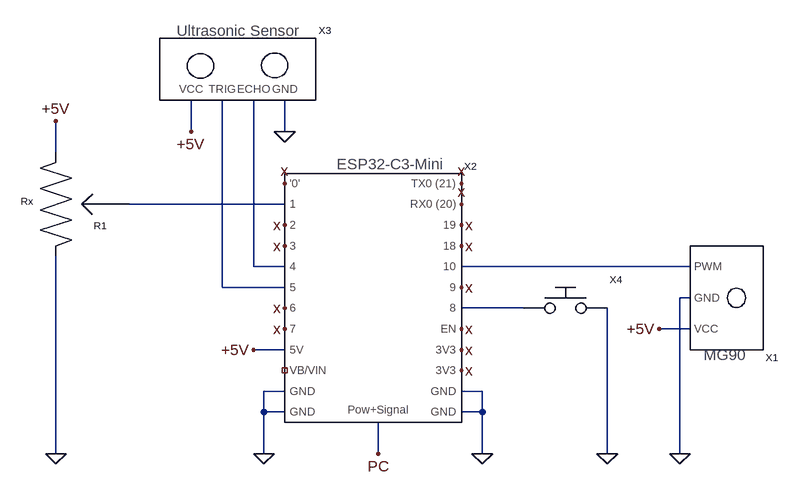
[diagram p0: schematic radar_schematic.asc]
radar_schematic.asc, the LTspice schematic file:
Version 4.1
SHEET 1 1668 1076
WIRE 640 128 640 80
WIRE 784 128 784 80
WIRE 432 160 432 112
WIRE 784 240 544 240
WIRE 736 336 736 80
WIRE 784 336 736 336
WIRE 1408 336 1056 336
WIRE 688 368 688 80
WIRE 784 368 688 368
WIRE 1408 384 1392 384
WIRE 1152 400 1056 400
WIRE 1408 432 1360 432
WIRE 784 464 736 464
WIRE 784 528 752 528
WIRE 1088 528 1056 528
WIRE 752 560 752 528
WIRE 784 560 752 560
WIRE 1088 560 1088 528
WIRE 1088 560 1056 560
WIRE 432 624 432 320
WIRE 752 624 752 560
WIRE 928 624 928 576
WIRE 1088 624 1088 560
WIRE 1280 624 1280 400
WIRE 1392 624 1392 384
FLAG 1088 624 0
FLAG 752 624 0
FLAG 640 128 +5V
FLAG 1360 432 +5V
FLAG 784 128 0
FLAG 784 208 x
FLAG 784 272 x
FLAG 784 400 x
FLAG 784 432 x
FLAG 1056 464 x
FLAG 1056 496 x
FLAG 1056 432 x
FLAG 1056 368 x
FLAG 1056 304 x
FLAG 1056 272 x
FLAG 1056 240 x
FLAG 1056 208 x
FLAG 928 624 PC
FLAG 736 464 +5V
FLAG 432 112 +5V
FLAG 432 624 0
FLAG 1280 624 0
FLAG 1392 624 0
FLAG 784 304 x
SYMBOL symbols\\servo_motor 1440 384 M180
SYMATTR InstName X1
SYMBOL symbols\\esp32_c3_mini 832 272 R0
SYMATTR InstName X2
SYMBOL symbols\\ultrasonic_sensor 704 96 R0
SYMATTR InstName X3
SYMBOL symbols\\potentiometer 496 304 R0
SYMATTR InstName R1
SYMBOL symbols\\push_button 1216 400 R0
SYMATTR InstName X4

The netlist it stands for:
* radar_schematic.asc
X§X1 +5V 0 N003 servo_motor  ; pins VCC GND PWM
X§X2 x N001 x x N002 N004 x x +5V NC_01 0 0 x x x x N003 x N005 x x x 0 0 PC esp32_c3_mini  ; pins '0' 1 2 3 4 5 6 7 5V VB/VIN GND GND TX0_(21) RX0_(20) 19 18 10 9 8 EN 3V3 3V3 GND GND Pow+Signal
X§X3 +5V N004 N002 0 ultrasonic_sensor  ; pins VCC TRIG ECHO GND
R1 N001 0 +5V Rx
X§X4 N005 0 push_button
.backanno
.end